# Altium project Плата коммутации.PrjPcb
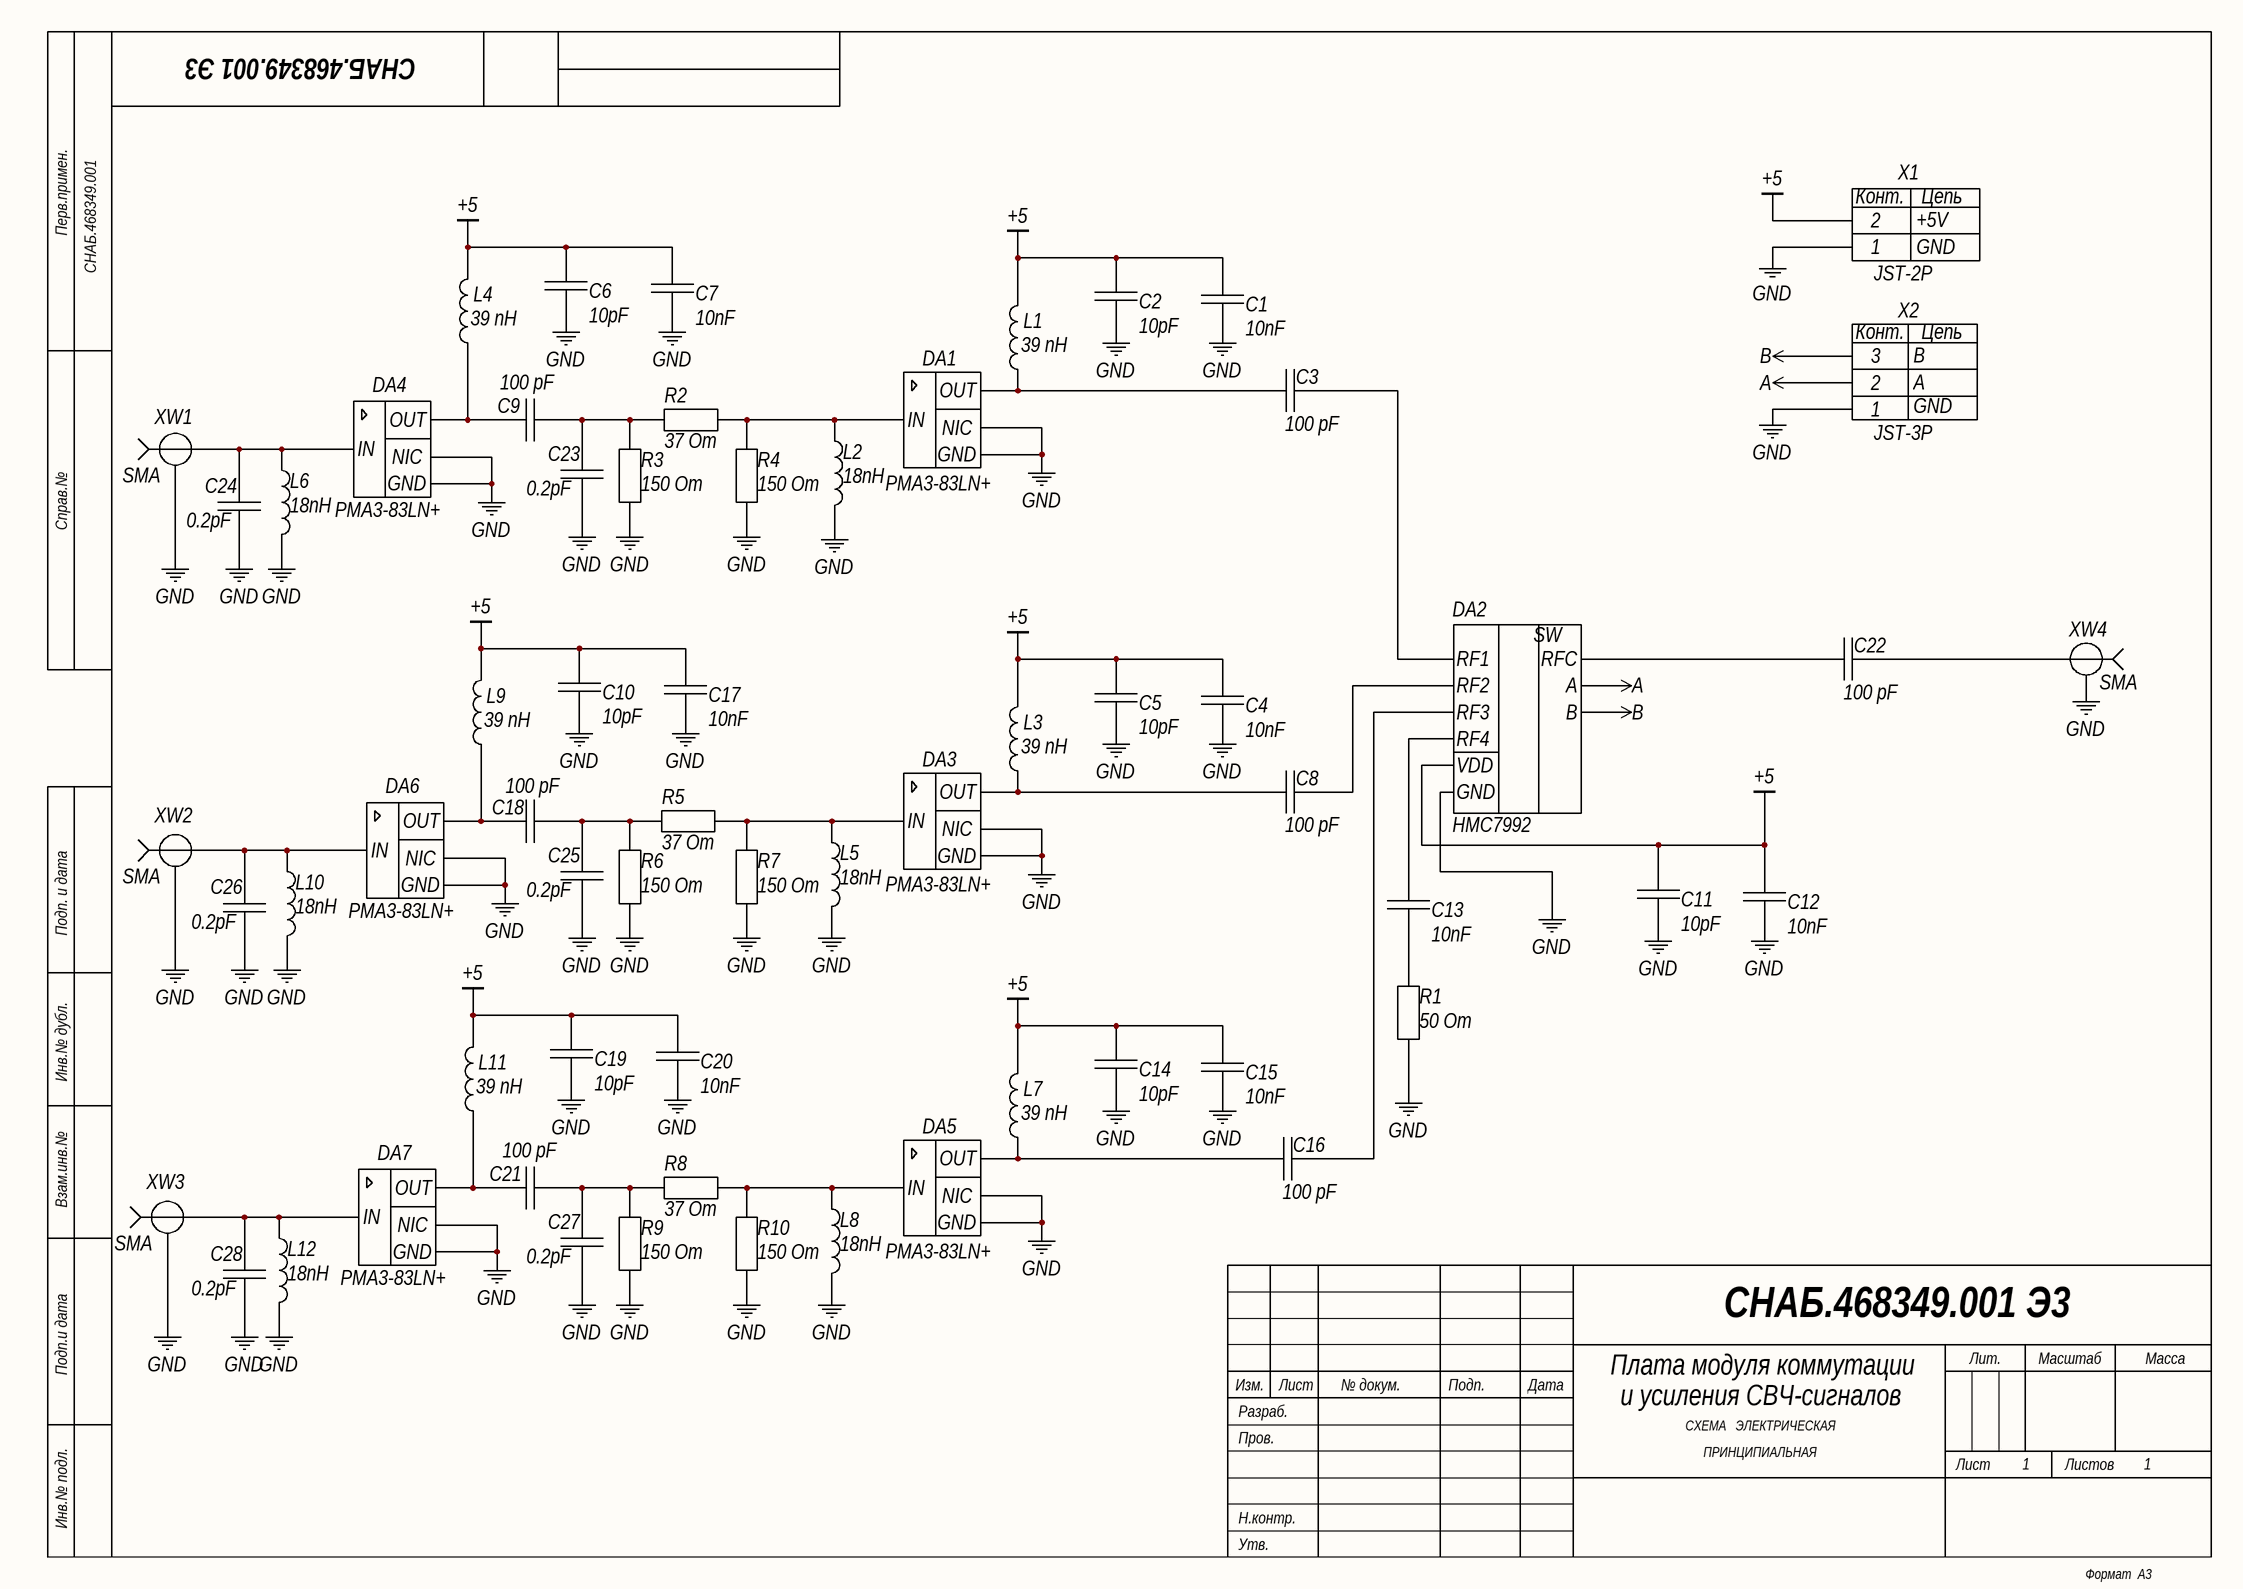
[diagram p0: Принципиальная схема ЕСКД.SchDoc]
Вид_документа: СНАБ.468534 .001; Вид_документа_PCB: СНАБ.468534 .001; Наименование: СНАБ.468534 .001; Наименование1: СНАБ.468534 .001; Наименование_PCB: СНАБ.468534 .001; Обозначение: СНАБ.468534 .001; Обозначение_PCB: СНАБ.468534 .001; Обозначение_Код: СНАБ.468534 .001
1 sheet, 63 parts. Net scope: global (net labels, ports and power ports of the same name join across sheets).
Board file: Печтаная плата.PcbDoc

## Sheet Принципиальная схема ЕСКД.SchDoc: Плата модуля коммутации и усиления СВЧ-сигналов
size 420 x 297 mm; SheetNumber: 1; SheetTotal: 1; PageSetup: Record=PageOptions|CenterHorizontal=True|CenterVertical=True|PrintScale=0.94|XCorrection=1.00|YCorrection=1.00|PrintKind=1|BorderSize=5000000|LeftOffset=0|BottomOffset=0|Orientation=1|PaperLength=1000|PaperWidth=1000|Scale=100|PaperSource=7|PrintQuality=-4|MediaType=1|DitherType=10|PaperKind=A4|PrintScaleMode=1; DecimalNumber: СНАБ.468349.001; MainDevice: СНАБ.468349.001; Name1: Плата модуля коммутации; Name2: и усиления СВЧ-сигналов; Net1: GND; DocumentName: Sheet1.SCHDOC

### Parts
C1  10nF  [FP-GJM155-0_05-IPC_A]
C2  10pF  [FP-GJM155-0_05-IPC_A]
C3  100 pF  [FP-GJM155-0_05-IPC_A]
C4  10nF  [FP-GJM155-0_05-IPC_A]
C5  10pF  [FP-GJM155-0_05-IPC_A]
C6  10pF  [FP-GJM155-0_05-IPC_A]
C7  10nF  [FP-GJM155-0_05-IPC_A]
C8  100 pF  [FP-GJM155-0_05-IPC_A]
C9  100 pF  [FP-GJM155-0_05-IPC_A]
C10  10pF  [FP-GJM155-0_05-IPC_A]
C11  10pF  [FP-GJM155-0_05-IPC_A]
C12  10nF  [FP-GJM155-0_05-IPC_A]
C13  10nF  [FP-GJM155-0_05-IPC_A]
C14  10pF  [FP-GJM155-0_05-IPC_A]
C15  10nF  [FP-GJM155-0_05-IPC_A]
C16  100 pF  [FP-GJM155-0_05-IPC_A]
C17  10nF  [FP-GJM155-0_05-IPC_A]
C18  100 pF  [FP-GJM155-0_05-IPC_A]
C19  10pF  [FP-GJM155-0_05-IPC_A]
C20  10nF  [FP-GJM155-0_05-IPC_A]
C21  100 pF  [FP-GJM155-0_05-IPC_A]
C22  100 pF  [FP-GJM155-0_05-IPC_A]
C23  0.2pF  [FP-C0402-parallel-coplanar]
C24  0.2pF  [FP-C0402-parallel-coplanar]
C25  0.2pF  [FP-C0402-parallel-coplanar]
C26  0.2pF  [FP-C0402-parallel-coplanar]
C27  0.2pF  [FP-C0402-parallel-coplanar]
C28  0.2pF  [FP-C0402-parallel-coplanar]
DA1  PMA3-83LN+  [FP-DQ1225-IPC_A]
DA2  HMC7992  [FP-CP-16-38-IPC_A]
DA3  PMA3-83LN+  [FP-DQ1225-IPC_A]
DA4  PMA3-83LN+  [FP-DQ1225-IPC_A]
DA5  PMA3-83LN+  [FP-DQ1225-IPC_A]
DA6  PMA3-83LN+  [FP-DQ1225-IPC_A]
DA7  PMA3-83LN+  [FP-DQ1225-IPC_A]
L1  39 nH  [FP-0402HP-MFG]
L2  18nH  [FP-0402HP-MFG]
L3  39 nH  [FP-0402HP-MFG]
L4  39 nH  [FP-0402HP-MFG]
L5  18nH  [FP-0402HP-MFG]
L6  18nH  [FP-0402HP-MFG]
L7  39 nH  [FP-0402HP-MFG]
L8  18nH  [FP-0402HP-MFG]
L9  39 nH  [FP-0402HP-MFG]
L10  18nH  [FP-0402HP-MFG]
L11  39 nH  [FP-0402HP-MFG]
L12  18nH  [FP-0402HP-MFG]
R1  50 Om  [FP-CR0402-IPC_A]
R2  37 Om  [FP-CR0402-IPC_A-parallel-coplanar]
R3  150 Om  [FP-CR0402-IPC_A-parallel-coplanar]
R4  150 Om  [FP-CR0402-IPC_A-parallel-coplanar]
R5  37 Om  [FP-CR0402-IPC_A-parallel-coplanar]
R6  150 Om  [FP-CR0402-IPC_A-parallel-coplanar]
R7  150 Om  [FP-CR0402-IPC_A-parallel-coplanar]
R8  37 Om  [FP-CR0402-IPC_A-parallel-coplanar]
R9  150 Om  [FP-CR0402-IPC_A-parallel-coplanar]
R10  150 Om  [FP-CR0402-IPC_A-parallel-coplanar]
X1  JST-2P  [FP-S2B-XH-A-1_LF_SN-MFG]
X2  JST-3P  [FP-S3B-XH-A-1_LF_SN-MFG]
XW1  SMA  [S-P2152-19CQA]
XW2  SMA  [S-P2152-19CQA]
XW3  SMA  [S-P2152-19CQA]
XW4  SMA  [S-P2152-19CQA]

### Nets
+5: C1.1 C2.1 C4.1 C5.1 C6.1 C7.1 C10.1 C11.1 C12.1 C14.1 C15.1 C17.1 C19.1 C20.1 DA2.6(VDD) L1.2 L3.2 L4.2 L7.2 L9.2 L11.2 X1.2
GND: C1.2 C2.2 C4.2 C5.2 C6.2 C7.2 C10.2 C11.2 C12.2 C14.2 C15.2 C17.2 C19.2 C20.2 C23.1 C24.1 C25.1 C26.1 C27.1 C28.1 DA1.1,3,4,5,6,7,9,10(NIC) DA1.13(GND) DA2.2,_3,_5,_10,_11,_13,_14,_16,_17(GND) DA3.1,3,4,5,6,7,9,10(NIC) DA3.13(GND) DA4.1,3,4,5,6,7,9,10(NIC) DA4.13(GND) DA5.1,3,4,5,6,7,9,10(NIC) DA5.13(GND) DA6.1,3,4,5,6,7,9,10(NIC) DA6.13(GND) DA7.1,3,4,5,6,7,9,10(NIC) DA7.13(GND) L2.2 L5.2 L6.2 L8.2 L10.2 L12.2 R1.1 R3.1 R4.2 R6.1 R7.2 R9.1 R10.2 X1.1 X2.1 XW1.2 XW2.2 XW3.2 XW4.2
A: DA2.8(A) X2.2
B: DA2.7(B) X2.3
NetC3_1: C3.1 DA2.12(RF1)
NetC3_2: C3.2 DA1.8(OUT) L1.1
NetC8_1: C8.1 DA2.9(RF2)
NetC8_2: C8.2 DA3.8(OUT) L3.1
NetC9_1: C9.1 C23.2 R2.2 R3.2
NetC9_2: C9.2 DA4.8(OUT) L4.1
NetC13_1: C13.1 DA2.1(RF4)
NetC13_2: C13.2 R1.2
NetC16_1: C16.1 DA2.4(RF3)
NetC16_2: C16.2 DA5.8(OUT) L7.1
NetC18_1: C18.1 C25.2 R5.2 R6.2
NetC18_2: C18.2 DA6.8(OUT) L9.1
NetC21_1: C21.1 C27.2 R8.2 R9.2
NetC21_2: C21.2 DA7.8(OUT) L11.1
NetC22_1: C22.1 XW4.1
NetC22_2: C22.2 DA2.15(RFC)
NetC24_2: C24.2 DA4.2(IN) L6.1 XW1.1
NetC26_2: C26.2 DA6.2(IN) L10.1 XW2.1
NetC28_2: C28.2 DA7.2(IN) L12.1 XW3.1
NetDA1_2: DA1.2(IN) L2.1 R2.1 R4.1
NetDA3_2: DA3.2(IN) L5.1 R5.1 R7.1
NetDA5_2: DA5.2(IN) L8.1 R8.1 R10.1

### Notes on the sheet
- Перв.примен.
- Справ.№
- Подп. и дата
- Инв.№ дубл.
- Взам.инв.№
- Подп.и дата
- Разраб.
- Изм.
- Лист
- № докум.
- Подп.
- Дата
- Лит.
- Масштаб
- Масса
- Пров.
- СХЕМА   ЭЛЕКТРИЧЕСКАЯ
- ПРИНЦИПИАЛЬНАЯ
- Листов
- Инв.№ подл.
- Утв.
- Н.контр.
- Формат  A3
- (in symbol HMC7992) SW
- (in symbol JST-2P) Конт.; Цепь
- (in symbol JST-3P) Конт.; Цепь

### Library data of the parts
C1 C4 C7 C12 C13 C15 C17 C20 = C: Part_number: GRM1555C1H101JA01D; Manufacturer: Murata; Dielectric: COG; Tolerance: 10%; VDC: 25; Value: 10nF; Package: 0402
C2 C5 C6 C10 C11 C14 C19 = C: Part_number: GJM1555C1H100JB01D; Manufacturer: Murata; Dielectric: C0G; Tolerance: 5%; VDC: 50; Value: 10pF; Package: 0402
C3 C8 C9 C16 C18 C21 C22 = C: Part_number: GRM1555C1H101JA01D; Manufacturer: Murata; Value: 100pF; Dielectric: COG; Tolerance: 5%; VDC: 50; Package: 0402
C23-C28 = C: Part_number: GJM1555C1H100JB01D; Value: 10pF
DA1 DA3-DA7 = PMA3-83LN+: Part_number: PMA3-83LNW+
DA2 = HMC7992: Part_number: HMC7992LP3DETR
L1 L3 L4 L7 L9 L11 = L: Part_number: 0402CS-39NXGLW; Manufacturer: Coilcraft; Value: 39nH; Tolerance: 5%; Package: 0402
L2 L5 L6 L8 L10 L12 = L: Part_number: LQP15MN18NJ02D; Manufacturer: Murata; Tolerance: 5%; Value: 18nH; Package: 0402
R1 = R: Part_number: RT0402BRE0750RL; Manufacturer: YAGEO; Tolerance: 0.1%; Value: 50 Om; Package: 0402
R2-R10 = R: Part_number: RT0402BRE0750RL; Value: 50 Om
X1 = JST-2P: JST type connector; Part_number: S2B-XH-A(LF)(SN; Net1: GND; Net2: +5V
X2 = JST-3P: JST type connector; Part_number: S3B-XH-A(LF)(SN; Net1: GND; Net2: A; Net3: B
XW1-XW4 = SMA: Part_number: S-P2152-19CQA